# Altium schematic sheet 1_toplevel.SchDoc
size A; SheetNumber: 1; SheetTotal: 7
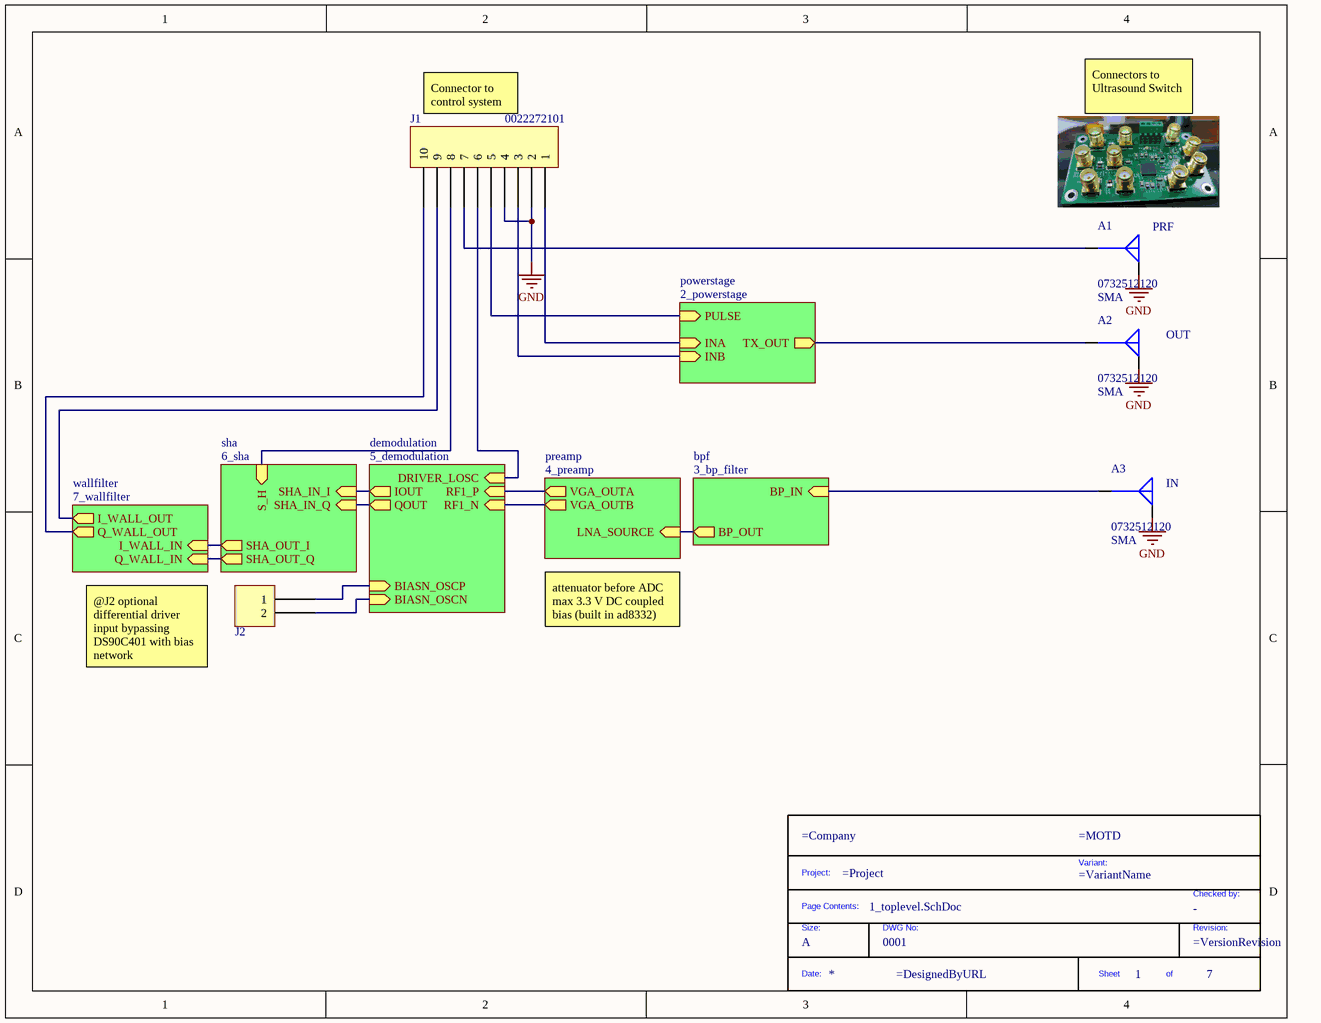
[diagram p0: 1_toplevel.SchDoc]

## Parts
*?  DWG No: 0001  Size: A  (hidden comment: TitleBlock)  (graphical)
A1  0732512120  Connector Style: SMA  [MOLEX SD-73251-212]
A2  0732512120  Connector Style: SMA  [MOLEX SD-73251-212]
A3  0732512120  Connector Style: SMA  [MOLEX SD-73251-212]
J1  0022272101  [MOLEX KK 0022272101]
J2  0022272021  [MOLEX KK 0022272021]  (value not drawn)

## Sub-sheets
bpf = 3_bp_filter: BP_IN (in), BP_OUT (out)
demodulation = 5_demodulation: RF1_P (in), RF1_N (in), IOUT (out), QOUT (out), BIASN_OSCP (in), BIASN_OSCN (in), DRIVER_LOSC (in)
powerstage = 2_powerstage: INA (in), INB (in), TX_OUT (out), PULSE (in)
preamp = 4_preamp: LNA_SOURCE (in), VGA_OUTA (out), VGA_OUTB (out)
sha = 6_sha: SHA_IN_I (in), SHA_IN_Q (in), S_H (in), SHA_OUT_I (out), SHA_OUT_Q (out)
wallfilter = 7_wallfilter: I_WALL_IN (in), Q_WALL_IN (in), I_WALL_OUT (out), Q_WALL_OUT (out)

## Nets
GND: A1.G A2.G A3.G J1.2 J1.4
NetA1_S: A1.S J1.7
NetA2_S: A2.S ; sheet powerstage/TX_OUT
NetA3_S: A3.S ; sheet bpf/BP_IN
NetJ1_1: J1.1 ; sheet powerstage/INA
NetJ1_3: J1.3 ; sheet powerstage/INB
NetJ1_5: J1.5 ; sheet powerstage/PULSE
NetJ1_6: J1.6 ; sheet demodulation/DRIVER_LOSC
NetJ1_8: J1.8 ; sheet sha/S_H
NetJ1_9: J1.9 ; sheet wallfilter/I_WALL_OUT
NetJ1_10: J1.10 ; sheet wallfilter/Q_WALL_OUT
NetJ2_1: J2.1 ; sheet demodulation/BIASN_OSCP
NetJ2_2: J2.2 ; sheet demodulation/BIASN_OSCN
(unnamed): sheet preamp/LNA_SOURCE, sheet bpf/BP_OUT
(unnamed): sheet preamp/VGA_OUTA, sheet demodulation/RF1_P
(unnamed): sheet preamp/VGA_OUTB, sheet demodulation/RF1_N
(unnamed): sheet demodulation/IOUT, sheet sha/SHA_IN_I
(unnamed): sheet demodulation/QOUT, sheet sha/SHA_IN_Q
(unnamed): sheet wallfilter/I_WALL_IN, sheet sha/SHA_OUT_I
(unnamed): sheet wallfilter/Q_WALL_IN, sheet sha/SHA_OUT_Q

## Notes on the sheet
- Connector to control system
- Connectors to Ultrasound Switch
- (near A1) PRF
- (near A2) OUT
- (near A3) IN
- attenuator before ADC
  max 3.3 V DC coupled bias (built in ad8332)
- @J2 optional differential driver input bypassing DS90C401 with bias network
- (in symbol TitleBlock) Project:; Variant:; Checked by:; Page Contents:; Size:; DWG No:; Revision:; Date:; Sheet; of

## Library data of the parts
*? = TitleBlock: Standard Title Block; Checked by: -
A1-A3 = 0732512120: CONN SMA JACK STR 50OHM EDGE MNT; Manufacturer: Molex; Connector Type: Jack, Female Socket; Contact Termination: Solder; Frequency - Max: 18GHz; Number of Ports: 1; Part Number: 0732512120; ComponentLink1Description: Datasheet; ComponentLink1URL: https://www.molex.com/pdm_docs/sd/732512120_sd.pdf; ComponentLink2Description: DigiKey Link; ComponentLink2URL: http://digikey.com/product-detail/en/molex/0732512120/WM5536-ND/1465158; Fastening Type: Threaded; Housing Color: Gold; Impedance: 50Ohm; LastUpdated: 2022-06-29 18:09:19; Lifecycle Status: Active; Minimum Order: 1; Mounting Feature: Bulkhead - Front Side Nut; Mounting Type: Board Edge, End Launch; Panel Mount; Packaging: Bag; Part Status: Active; Price: 3.64; Series: 73251; Shield Termination: Solder; Supplier 1: DigiKey; Supplier Part Number 1: WM5536-ND
J1 = 0022272101: CONN HEADER VERT 10POS 2.54MM; Manufacturer: Molex; Contact Length - Mating: 0.295" (7.49mm); Contact Length - Post: 0.140" (3.56mm); Material Flammability Rating: UL94 V-0; Number of Positions: 10; Number of Positions Loaded: All; Overall Contact Length: 0.560" (14.22mm); Pitch - Mating: 0.100" (2.54mm); Shrouding: Shrouded - 1 Wall; Style: Board to Cable/Wire; Part Number: 0022272101; ComponentLink1Description: Datasheet; ComponentLink1URL: https://www.molex.com/pdm_docs/sd/022272101_sd.pdf; ComponentLink2Description: DigiKey Link; ComponentLink2URL: http://digikey.com/product-detail/en/molex/0022272101/WM4119-ND/1130585; Connector Type: Header; Contact Finish - Mating: Tin; Contact Finish - Post: Tin; Contact Finish Thickness - Mating: 100.0µin (2.54µm); Contact Material: Brass; Contact Shape: Square; Contact Type: Male Pin; Fastening Type: Friction Lock; Insulation Color: Natural; Insulation Height: 0.461" (11.70mm); Insulation Material: Polyamide (PA), Nylon; LastUpdated: 2020-01-12 23:53:02; Lifecycle Status: Active; Minimum Order: 1; Mounting Type: Through Hole; Number of Rows: 1; Packaging: Bulk; PartId: 84; Part Status: Active; Price: 0.73; Series: KK 6410; Supplier 1: DigiKey; Supplier Part Number 1: WM4119-ND; Termination: Solder
J2 = 0022272021: CONN HEADER VERT 2POS 2.54MM; Manufacturer: Molex; Contact Length - Mating: 0.295" (7.49mm); Contact Length - Post: 0.140" (3.56mm); Material Flammability Rating: UL94 V-0; Number of Positions: 2; Number of Positions Loaded: All; Overall Contact Length: 0.560" (14.22mm); Pitch - Mating: 0.100" (2.54mm); Shrouding: Shrouded - 1 Wall; Style: Board to Cable/Wire; Part Number: 0022272021; ComponentLink1Description: Datasheet; ComponentLink1URL: https://www.molex.com/pdm_docs/sd/022272021_sd.pdf; ComponentLink2Description: DigiKey Link; ComponentLink2URL: http://digikey.com/product-detail/en/molex/0022272021/WM4111-ND/1130577; Connector Type: Header; Contact Finish - Mating: Tin; Contact Finish - Post: Tin; Contact Finish Thickness - Mating: 100.0µin (2.54µm); Contact Material: Brass; Contact Shape: Square; Contact Type: Male Pin; Fastening Type: Friction Lock; Insulation Color: Natural; Insulation Height: 0.461" (11.70mm); Insulation Material: Polyamide (PA), Nylon; LastUpdated: 2020-01-12 23:51:43; Lifecycle Status: Active; Minimum Order: 1; Mounting Type: Through Hole; Number of Rows: 1; Packaging: Bulk; PartId: 76; Part Status: Active; Price: 0.27; Series: KK 6410; Supplier 1: DigiKey; Supplier Part Number 1: WM4111-ND; Termination: Solder